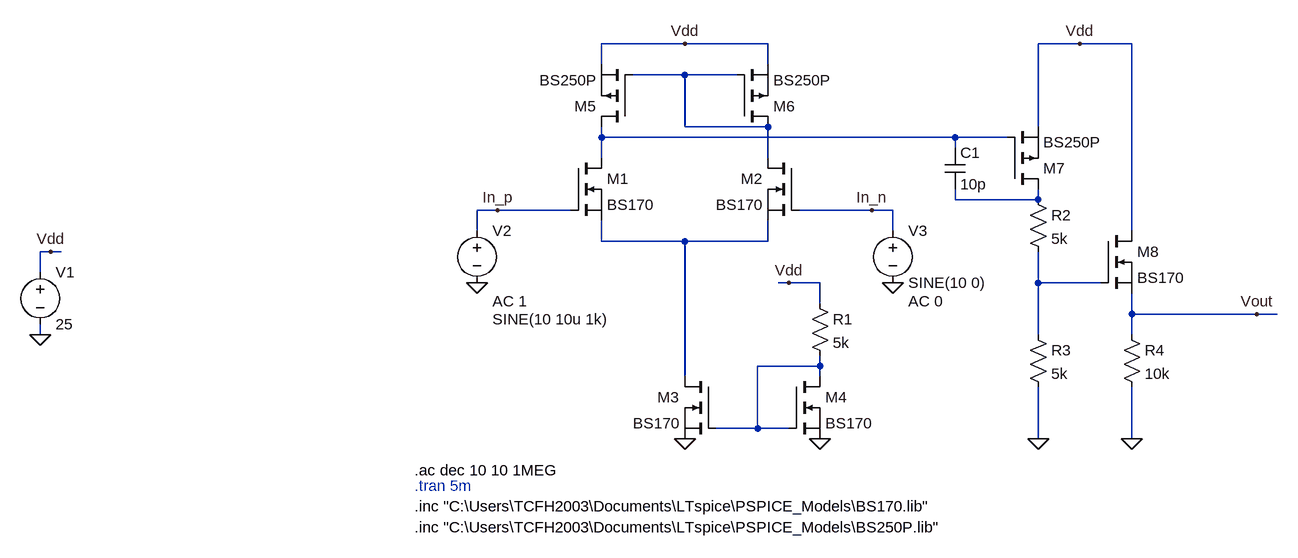
[diagram p0: schematic simple_opamp.asc]
simple_opamp.asc, the LTspice schematic file:
Version 4
SHEET 1 1132 696
WIRE 192 -64 64 -64
WIRE 320 -64 192 -64
WIRE 800 -64 736 -64
WIRE 880 -64 800 -64
WIRE 64 -32 64 -64
WIRE 320 -32 320 -64
WIRE 192 -16 112 -16
WIRE 272 -16 192 -16
WIRE 192 64 192 -16
WIRE 320 64 192 64
WIRE 736 64 736 -64
WIRE 64 80 64 64
WIRE 608 80 64 80
WIRE 688 80 608 80
WIRE 608 96 608 80
WIRE 64 112 64 80
WIRE 320 112 320 64
WIRE 608 176 608 160
WIRE 736 176 736 160
WIRE 736 176 608 176
WIRE -96 192 -128 192
WIRE 16 192 -96 192
WIRE 480 192 368 192
WIRE 512 192 480 192
WIRE -128 224 -128 192
WIRE 512 224 512 192
WIRE 880 224 880 -64
WIRE 64 240 64 208
WIRE 192 240 64 240
WIRE 320 240 320 208
WIRE 320 240 192 240
WIRE -784 256 -800 256
WIRE -768 256 -784 256
WIRE -800 288 -800 256
WIRE 352 304 336 304
WIRE 400 304 352 304
WIRE 736 304 736 256
WIRE 832 304 736 304
WIRE 400 336 400 304
WIRE 880 352 880 320
WIRE 1072 352 880 352
WIRE 1104 352 1072 352
WIRE -800 384 -800 368
WIRE 736 384 736 304
WIRE 880 384 880 352
WIRE 400 432 400 416
WIRE 400 432 304 432
WIRE 192 448 192 240
WIRE 400 448 400 432
WIRE 304 528 304 432
WIRE 304 528 240 528
WIRE 352 528 304 528
WIRE 736 544 736 464
WIRE 880 544 880 464
FLAG 192 544 0
FLAG 400 544 0
FLAG 352 304 Vdd
FLAG 480 192 In_n
FLAG -96 192 In_p
FLAG 192 -64 Vdd
FLAG -800 384 0
FLAG -784 256 Vdd
FLAG -128 304 0
FLAG 512 304 0
FLAG 800 -64 Vdd
FLAG 736 544 0
FLAG 880 544 0
FLAG 1072 352 Vout
SYMBOL nmos 16 112 R0
SYMATTR InstName M1
SYMATTR Value BS170
SYMBOL nmos 368 112 M0
SYMATTR InstName M2
SYMATTR Value BS170
SYMBOL nmos 240 448 M0
SYMATTR InstName M3
SYMATTR Value BS170
SYMBOL nmos 352 448 R0
SYMATTR InstName M4
SYMATTR Value BS170
SYMBOL res 384 320 R0
SYMATTR InstName R1
SYMATTR Value 5k
SYMBOL pmos 112 64 R180
SYMATTR InstName M5
SYMATTR Value BS250P
SYMBOL pmos 272 64 M180
SYMATTR InstName M6
SYMATTR Value BS250P
SYMBOL voltage -800 272 R0
WINDOW 123 0 0 Left 0
WINDOW 39 0 0 Left 0
SYMATTR InstName V1
SYMATTR Value 25
SYMBOL voltage -128 208 R0
WINDOW 3 24 152 Left 2
WINDOW 123 24 124 Left 2
WINDOW 39 0 0 Left 0
SYMATTR InstName V2
SYMATTR Value SINE(10 10u 1k)
SYMATTR Value2 AC 1
SYMBOL voltage 512 208 R0
WINDOW 123 24 124 Left 2
WINDOW 39 0 0 Left 0
SYMATTR InstName V3
SYMATTR Value SINE(10 0)
SYMATTR Value2 AC 0
SYMBOL pmos 688 160 M180
SYMATTR InstName M7
SYMATTR Value BS250P
SYMBOL nmos 832 224 R0
SYMATTR InstName M8
SYMATTR Value BS170
SYMBOL res 720 160 R0
SYMATTR InstName R2
SYMATTR Value 5k
SYMBOL res 720 368 R0
SYMATTR InstName R3
SYMATTR Value 5k
SYMBOL res 864 368 R0
SYMATTR InstName R4
SYMATTR Value 10k
SYMBOL cap 592 96 R0
SYMATTR InstName C1
SYMATTR Value 10p
TEXT -224 648 Left 2 !.inc "C:\\Users\\TCFH2003\\Documents\\LTspice\\PSPICE_Models\\BS170.lib"
TEXT -224 680 Left 2 !.inc "C:\\Users\\TCFH2003\\Documents\\LTspice\\PSPICE_Models\\BS250P.lib"
TEXT -224 616 Left 2 ;.tran 5m
TEXT -224 592 Left 2 !.ac dec 10 10 1MEG

The netlist it stands for:
* simple_opamp.asc
M1 N002 In_p N004 N004 BS170
M2 N001 In_n N004 N004 BS170
M3 N004 N006 0 0 BS170
M4 N006 N006 0 0 BS170
R1 Vdd N006 5k
M5 N002 N001 Vdd Vdd BS250P
M6 N001 N001 Vdd Vdd BS250P
V1 Vdd 0 25
V2 In_p 0 SINE(10 10u 1k) AC 1
V3 In_n 0 SINE(10 0) AC 0
M7 N003 N002 Vdd Vdd BS250P
M8 Vdd N005 Vout Vout BS170
R2 N003 N005 5k
R3 N005 0 5k
R4 Vout 0 10k
C1 N002 N003 10p
.model NMOS NMOS
.model PMOS PMOS
.lib standard.mos
.inc "C:\Users\TCFH2003\Documents\LTspice\PSPICE_Models\BS170.lib"
.inc "C:\Users\TCFH2003\Documents\LTspice\PSPICE_Models\BS250P.lib"
* .tran 5m
.ac dec 10 10 1MEG
.backanno
.end

* Results of the author's LTspice run, read from the files saved beside the schematic
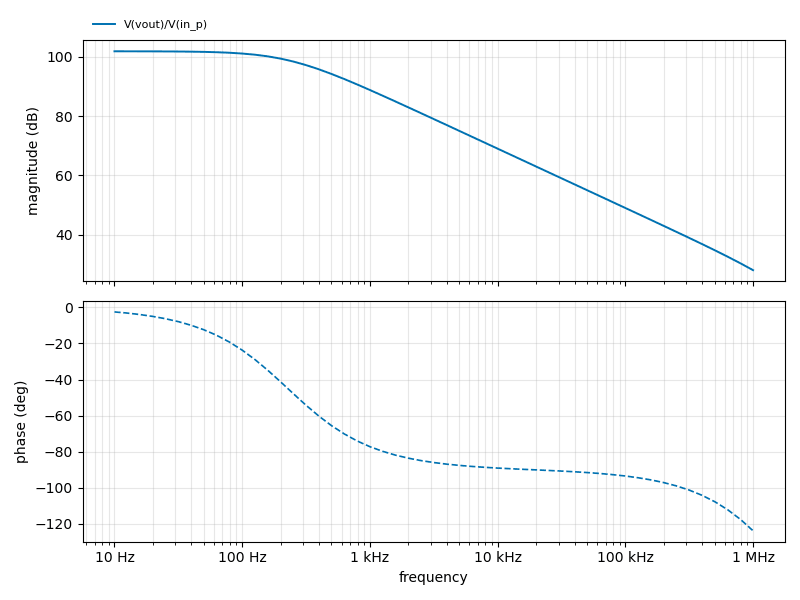
[diagram p1: AC Analysis of simple_opamp.asc, plotted from the saved traces]
* AC Analysis, 1 run:
*   V(vout)/V(in_p): 101.86 dB at 10 Hz, 28.04 dB at 1 MHz, peak 101.86 dB at 10 Hz, 3 dB below the peak at 226.8 Hz